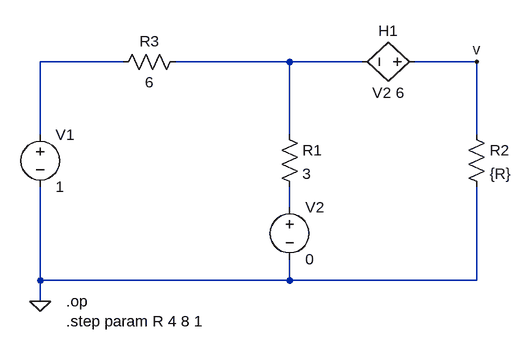
[diagram p0: schematic CH03-KP6-02.asc]
CH03-KP6-02.asc, the LTspice schematic file:
Version 4
SHEET 1 880 680
WIRE 32 192 -96 192
WIRE 288 192 112 192
WIRE 400 192 288 192
WIRE 576 192 480 192
WIRE -96 304 -96 192
WIRE 288 304 288 192
WIRE 576 304 576 192
WIRE 288 416 288 384
WIRE -96 528 -96 384
WIRE 288 528 288 496
WIRE 288 528 -96 528
WIRE 576 528 576 384
WIRE 576 528 288 528
WIRE -96 560 -96 528
FLAG -96 560 0
FLAG 576 192 v
SYMBOL res 272 288 R0
SYMATTR InstName R1
SYMATTR Value 3
SYMBOL res 560 288 R0
SYMATTR InstName R2
SYMATTR Value {R}
SYMBOL res 128 176 R90
WINDOW 0 0 56 VBottom 2
WINDOW 3 32 56 VTop 2
SYMATTR InstName R3
SYMATTR Value 6
SYMBOL voltage -96 288 R0
SYMATTR InstName V1
SYMATTR Value 1
SYMBOL voltage 288 400 R0
SYMATTR InstName V2
SYMATTR Value 0
SYMBOL h 496 192 R90
WINDOW 0 -32 56 VBottom 2
WINDOW 3 32 56 VTop 2
SYMATTR InstName H1
SYMATTR Value V2 6
TEXT -56 560 Left 2 !.op\n.step param R 4 8 1

The netlist it stands for:
* CH03-KP6-02.asc
R1 N002 N003 3
R2 v 0 {R}
R3 N002 N001 6
V1 N001 0 1
V2 N003 0 0
H1 v N002 V2 6
.op
.step param R 4 8 1
.backanno
.end